# Altium schematic sheet POWER.SchDoc
size A4; SheetNumber: 2; SheetTotal: 2
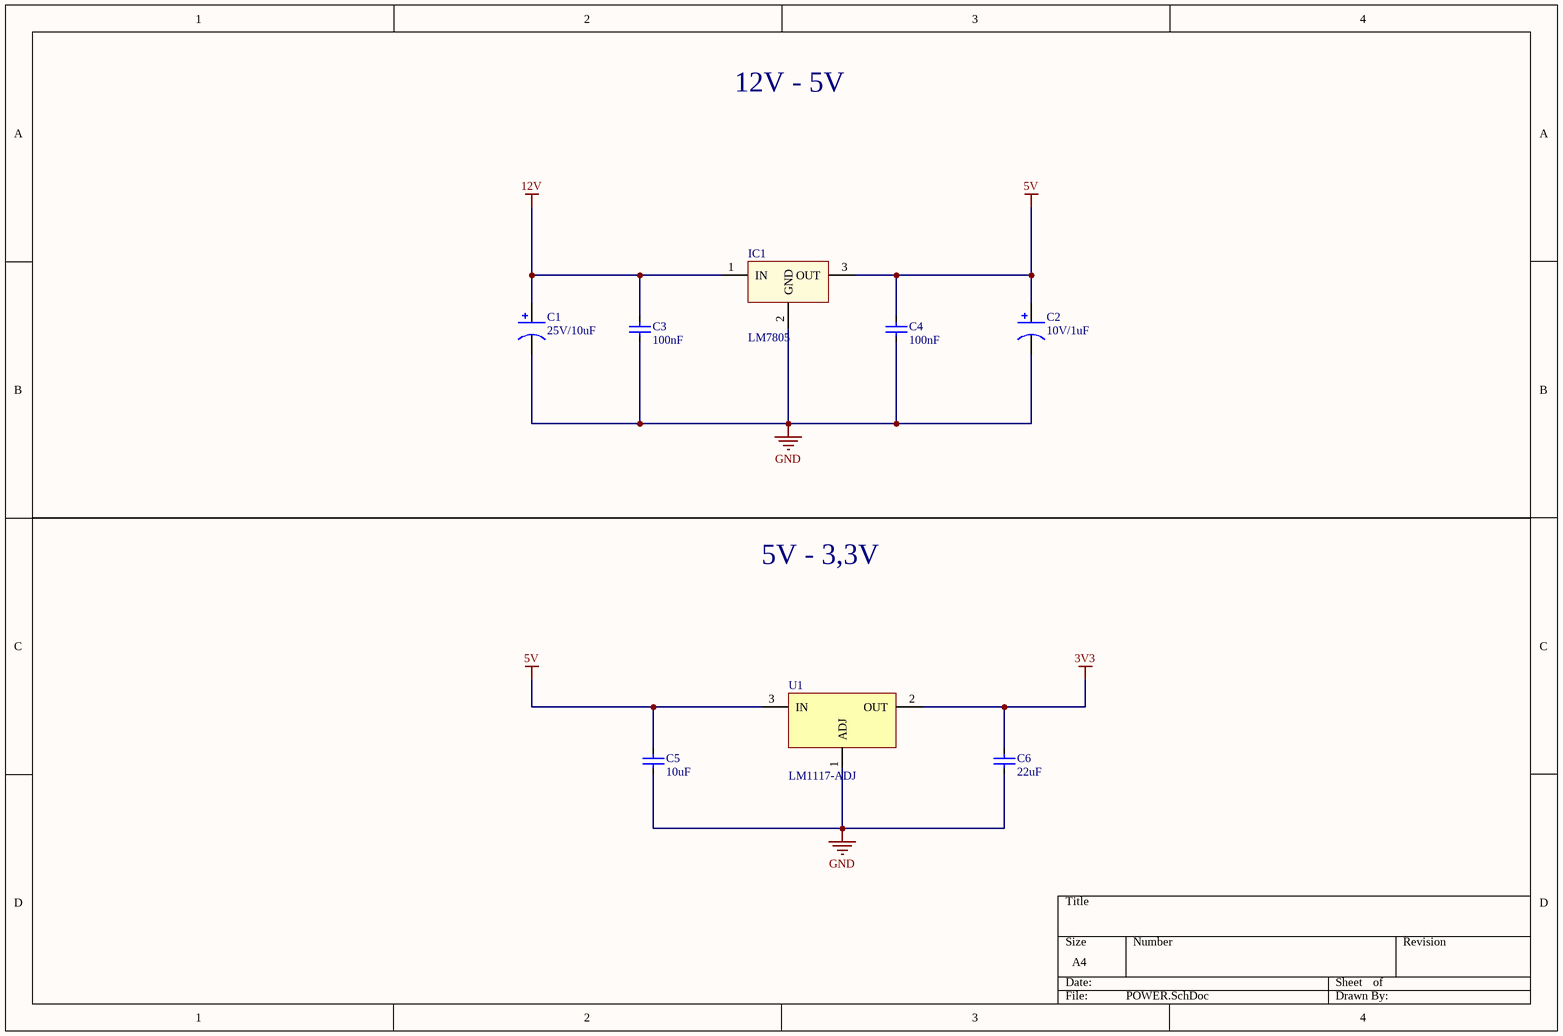
[diagram p0: POWER.SchDoc]

## Parts
C1  25V/10uF  [C3MM]
C2  10V/1uF  [C3MM]
C3  100nF  [CAP_0805]
C4  100nF  [CAP_0805]
C5  10uF  [CAP_0805]
C6  22uF  [CAP_0805]
IC1  LM7805  [QTO-220]
U1  LM1117-ADJ  [LM1117-SOP]

## Nets
3V3: C6.1 U1.2(OUT)
5V: C2.1 C4.1 C5.1 IC1.3(OUT) U1.3(IN)
12V: C1.1 C3.1 IC1.1(IN)
GND: C1.2 C2.2 C3.2 C4.2 C5.2 C6.2 IC1.2(GND) U1.1(ADJ)

## Notes on the sheet
- 12V - 5V
- 5V - 3,3V

## Library data of the parts
C1 C2 = Cap Pol: Polarized Capacitor (Axial); Published: 8-Jun-2000; LatestRevisionDate: 17-Jul-2002; LatestRevisionNote: Re-released for DXP Platform.; PackageReference: POLAR0.8; Publisher: Altium Limited
C3-C6 = CapSMD: Capacitor; Value: 33p; Published: 8-Jun-2000; LatestRevisionDate: 17-Jul-2002; LatestRevisionNote: Re-released for DXP Platform.; PackageReference: RAD-0.3; Publisher: Altium Limited
IC1 = LM78xx: On ap +, from + 5 to + 24VDC; Value: LM7805
U1 = LM1117-ADJ: 800mA Low-Dropout Linear Regulator; Creator: Nguyen Ba Bien; Website: http://group3i.net